# Altium project CMoy.PrjPcb
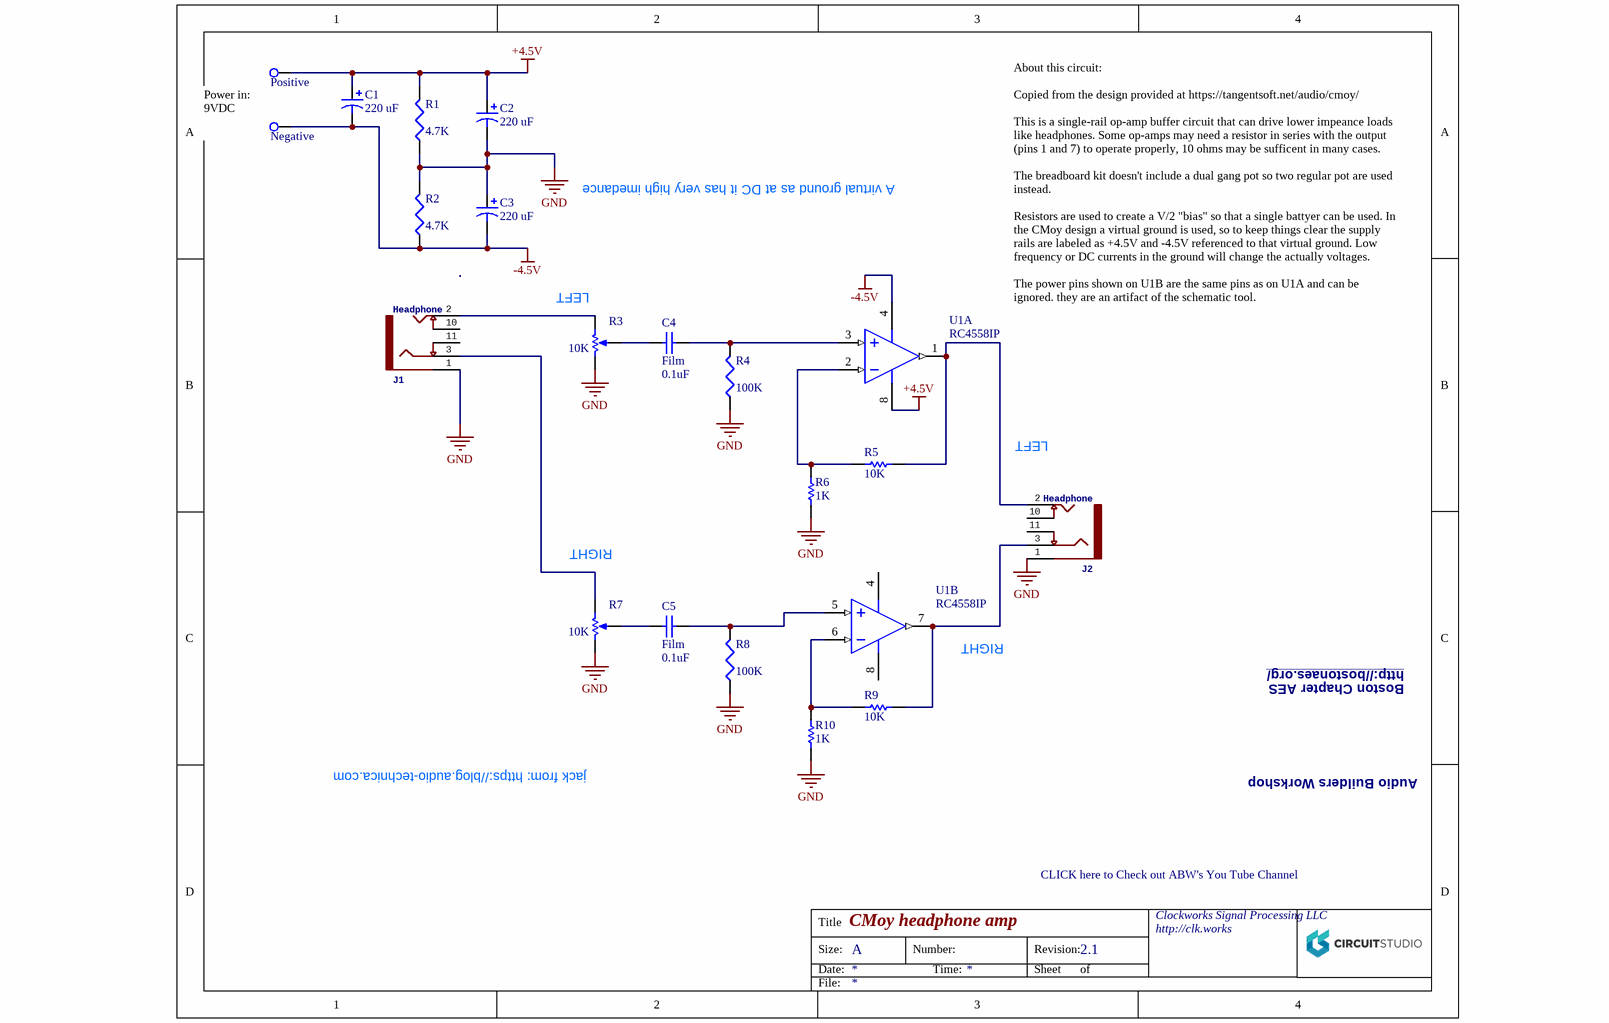
[diagram p0: CMoy.breadboard.SchDoc]
1 sheet, 20 parts. Net scope: global (net labels, ports and power ports of the same name join across sheets).

## Sheet CMoy.breadboard.SchDoc: CMoy headphone amp
size A; Organization: Clockworks Signal Processing LLC; Address1: http://clk.works; Revision: 2.1

### Parts
C1  value 220 uF  [RB7.6-15]  (hidden comment: Cap Pol1)
C2  value 220 uF  [RB7.6-15]  (hidden comment: Cap Pol1)
C3  value 220 uF  [RB7.6-15]  (hidden comment: Cap Pol1)
C4  Film  value 0.1uF  [RAD-0.3]
C5  Film  value 0.1uF  [RAD-0.3]
J1  Headphone  [SWITCHCRAFT_35RAPC4BHN2]
J2  Headphone  [SWITCHCRAFT_35RAPC4BHN2]
R1  value 4.7K  [J1-0603]  (hidden comment: Res3)
R2  value 4.7K  [J1-0603]  (hidden comment: Res3)
R3  value 10K  [VR5]  (hidden comment: RPot)
R4  value 100K  [J1-0603]  (hidden comment: Res3)
R5  10K  [SL Axial 10k 1/4W]
R6  1K  [SL Axial 1k 1/4W]
R7  value 10K  [VR5]  (hidden comment: RPot)
R8  value 100K  [J1-0603]  (hidden comment: Res3)
R9  10K  [SL Axial 10k 1/4W]
R10  1K  [SL Axial 1k 1/4W]
TP1  Positive  [SL TEST POINT]  (no BOM)
TP2  Negative  [SL TEST POINT]  (no BOM)
U1  RC4558IP  [P0008A]  (parts A,B of 2)

### Nets
+4.5V: C1.1 C2.1 R1.2 TP1.1(TP) U1.8(VCC+)
-4.5V: C1.2 C3.2 R2.1 TP2.1(TP) U1.4(VCC-)
GND: C2.2 C3.1 J1.1(SLEEVE) J2.1(SLEEVE) R1.1 R2.2 R3.2(BOT) R4.1 R6.1 R7.2(BOT) R8.1 R10.1
NetC4_1: C4.1 R3.3(TAP)
NetC4_2: C4.2 R4.2 U1.3(IN1+)
NetC5_1: C5.1 R7.3(TAP)
NetC5_2: C5.2 R8.2 U1.5(IN2+)
NetJ1_2: J1.2(TIP) R3.1(TOP)
NetJ1_3: J1.3(RING) R7.1(TOP)
NetJ2_2: J2.2(TIP) R5.2 U1.1(OUT1)
NetJ2_3: J2.3(RING) R9.2 U1.7(OUT2)
NetR5_1: R5.1 R6.2 U1.2(IN1-)
NetR9_1: R9.1 R10.2 U1.6(IN2-)

Not connected (* = marked no-connect by the designer): J1 10(TSH) 11(RSH); J2 10(TSH) 11(RSH)

### Notes on the sheet
- Power in: 9VDC
- A virtual ground as at DC it has very high imedance
- (near R3) LEFT
- About this circuit:
  Copied from the design provided at https://tangentsoft.net/audio/cmoy/
  This is a single-rail op-amp buffer circuit that can drive lower impeance loads like headphones. Some op-amps may need a resistor in series with the output (pins 1 and 7) to operate properly, 10 ohms may be sufficent in many cases.
  The breadboard kit doesn't include a dual gang pot so two regular pot are used instead.
  Resistors are used to create a V/2 "bias" so that a single battyer can be used. In the CMoy design a virtual ground is used, so to keep things clear the supply rails are labeled as +4.5V and -4.5V referenced to that virtual ground. Low frequency or DC currents in the ground will change the actually voltages.
  The power pins shown on U1B are the same pins as on U1A and can be ignored. they are an artifact of the schematic tool.
- LEFT
- (near R7) RIGHT
- RIGHT
- Boston Chapter AES
- http://bostonaes.org/
- jack from: https://blog.audio-technica.com
- Audio Builders Workshop
- CLICK here to Check out ABW's You Tube Channel <https://www.youtube.com/channel/UCL2QPbpqc7WbapSZI18CsWg>
- Title
- Size:
- Date:
- A
- Number:
- Time:
- Revision:
- Sheet
- of
- File:

### Library data of the parts
C1-C3 = Cap Pol1: Polarized Capacitor (Radial); Published: 8-Jun-2000; LatestRevisionDate: 17-Jul-2002; LatestRevisionNote: Re-released for DXP Platform.; PackageReference: RB7.6-15; Publisher: Altium Limited; PackageDescription: Polarized Capacitor (Radial); 2 Leads
C4 C5 = Cap: Capacitor; Published: 8-Jun-2000; LatestRevisionDate: 17-Jul-2002; LatestRevisionNote: Re-released for DXP Platform.; PackageReference: RAD-0.3; Publisher: Altium Limited; PackageDescription: Radial Cap, Thru-Hole; 2 Leads; 0.3 in Pin Spacing
J1 J2 = CSP-J0022-A: Conn 3.5MM Stereo Jack F 5 POS Solder RA Thru-Hole 5 Terminal 1 Port; CSPManufacturer 1: Switchcraft; GateName_1: G$1; SymbolName_1: 35RAPC4BHN2; CSPID: J0022; LibraryName: 35RAPC4BHN2; DeviceSetName: 35RAPC4BHN2; PartNumber 1: 35RAPC4BHN2; Price: 1.00 USD; Availability: Good; Package: None; Supplier 1: Newark; Supplier 2: Mouser; Supplier 3: Digi-Key; Supplier Part Number 1: 96F9607; Supplier Part Number 2: 502-35RAPC4BHN2; Supplier Part Number 3: SC1459-ND
R1 R2 R4 R8 = Res3: Resistor; Published: 8-Jun-2000; LatestRevisionDate: 29-May-2009; LatestRevisionNote: IPC-7351 Footprint Added.; PackageReference: J1-0603; Publisher: Altium Limited; PackageDescription: Chip Resistor
R3 R7 = RPot: Potentiometer; Sim Note: Enter the Resistance value and the set point into parameter fields.; Set Position: 0.5; Published: 8-Jun-2000; LatestRevisionDate: 17-Jul-2002; LatestRevisionNote: Re-released for DXP Platform.; PackageReference: VR5; Publisher: Altium Limited; PackageDescription: Variable Resistor, Thru-Hole; 3 Leads
R5 R9 = SL-R0020-A: 10K 1/4W TH; Partnumber 1: CF14JT10K0; CSPID: R0020; Value: 10K; Supplier 1: Newark; Supplier 2: Digi-Key; Supplier Part Number 1: 78Y4255; Supplier Part Number 2: CF14JT10K0CT-ND
R6 R10 = SL-R0016-A: 1K 1/4W TH; CSPID: R0016; Value: 1K; Supplier 1: Digi-Key; Supplier Part Number 1: CF14JT1K00CT-ND
TP1 TP2 = SL-X0005-A: Connection point; CSPID: X0005
U1 = CMP-0017-00906-2: Dual General-Purpose Operational Amplifier, 10 to 30 V, -40 to 85 degC, 8-pin DIP (P8), Pb-Free (RoHS); Manufacturer: Texas Instruments; GBW(Typ)(MHz): 3; IIB(Max)(pA): 500000; CMRR(Min)(dB): 70; Iq per channel(Max)(mA): 2.8; Sub Family: General Purpose Amplifier, High Supply Voltage Amplifier (>=30V), Low Noise Amp (<=10nV/rtHz); Slew Rate(Typ)(V/us): 1.7; Vio (25C)(Max)(mV): 6; Total Supply Voltage(Min)(+5V is 5, +/-5V is 10): 10; Vn at 1kHz(Typ)(nV/rtHz): 8; Number of Channels: 2; Total Supply Voltage(Max)(+5V is 5, +/-5V is 10): 30; PackageVersion: 4040082/E, 04/2010; ComponentLink3URL: http://www.ti.com/litv/pdf/mpdi001b; ComponentLink1URL: http://www.ti.com/; DatasheetVersion: SLOS073F; Mounting Technology: Through Hole; ComponentLink2Description: Datasheet; Code_JEDEC: MS-001; PartNumber: RC4558IP; ComponentLink2URL: http://www.ti.com/lit/ds/symlink/rc4558.pdf; ComponentLink3Description: Package Specification; PackageDescription: 8-Pin Plastic In-Line, Body 9.59 x 6.35 mm, Pitch 2.54 mm; Eco-Plan: Pb-Free (RoHS); ComponentLink1Description: Manufacturer URL; PackageReference: P0008A